# EAGLE schematic scale (EAGLE 9.6.2)
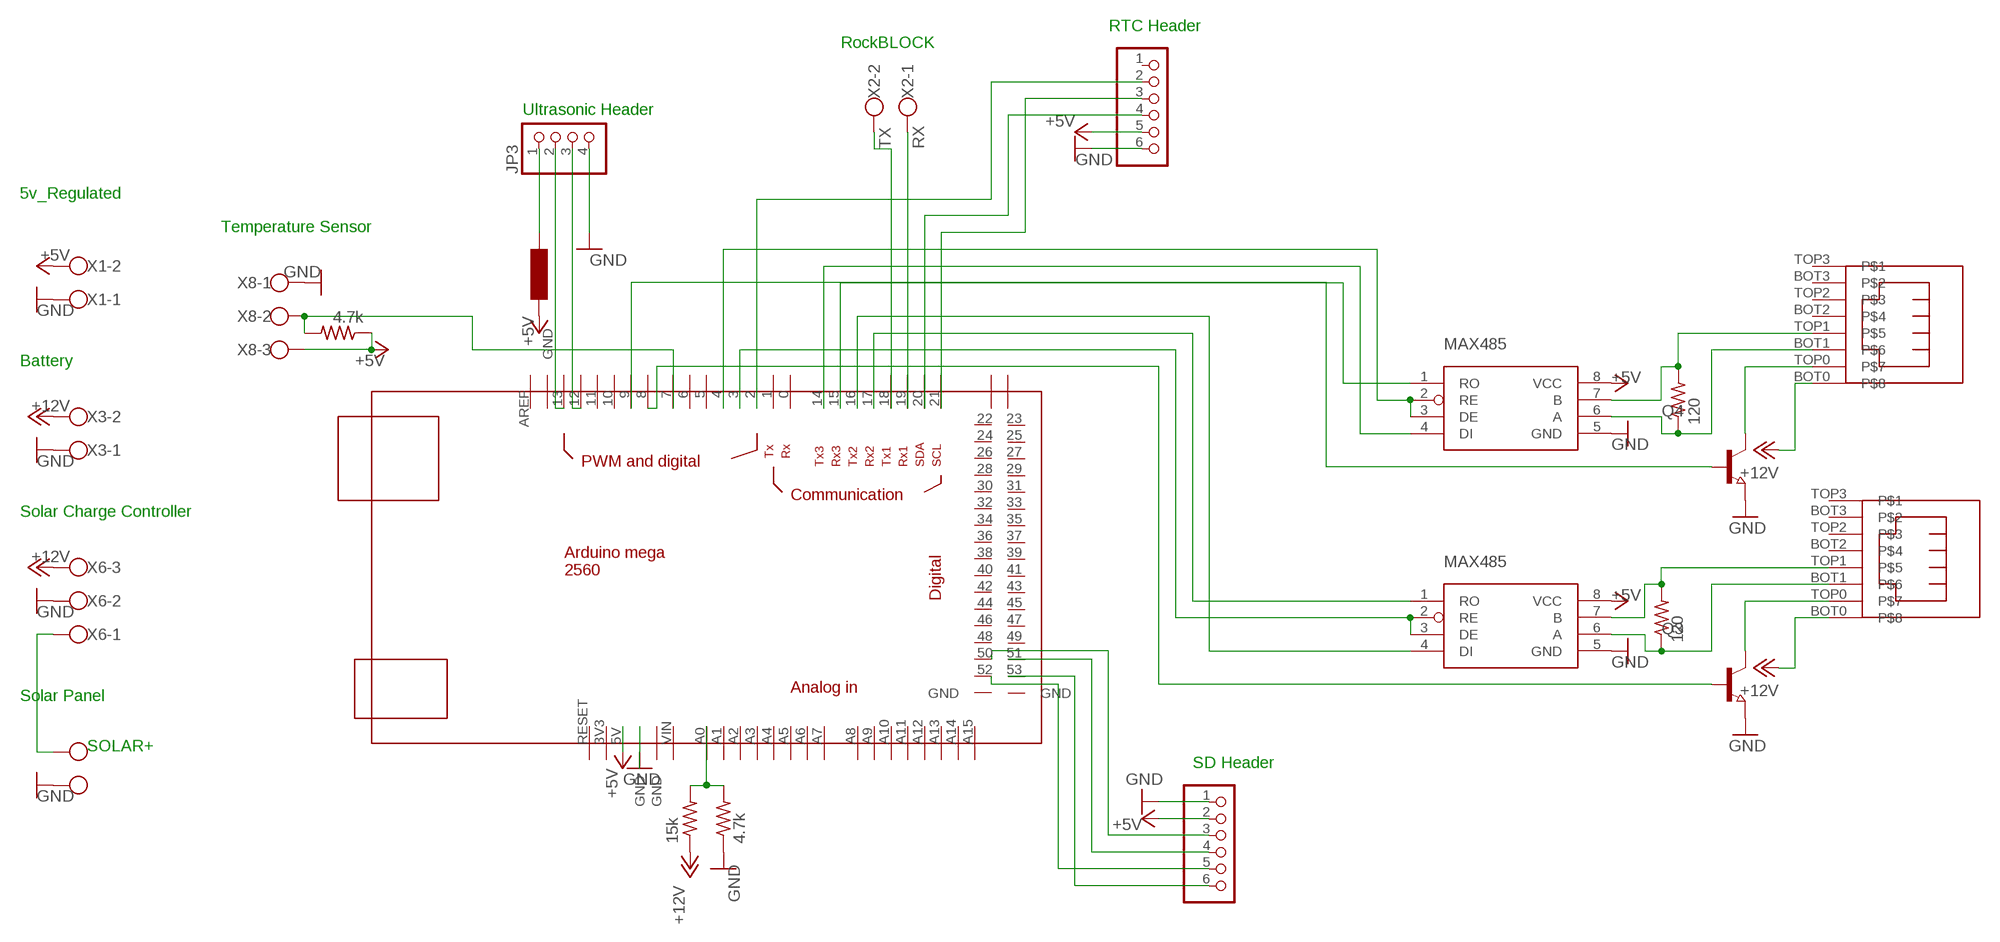
[diagram p0: schematic, sheet 1]

## Parts
JP1  PINHD-1X6  [1X06]
JP2  PINHD-1X6  [1X06]
JP3  PINHD-1X4  [1X04]
JP4  ETHERNET  [ETHERNET]
JP5  ETHERNET  [ETHERNET]
L1  100uH  NLFV32T-101K-EF  [NLFV32T-101K-EF]
Q3  NPN-TRANSISTOR_SOT23  [SOT23]
Q4  NPN-TRANSISTOR_SOT23  [SOT23]
R1  120  R-US_R0805  [R0805]
R3  4.7k  R-US_R0805  [R0805]
R7  120  R-US_R0805  [R0805]
R8  15k  R-US_R0805  [R0805]
R9  4.7k  R-US_R0805  [R0805]
U$1  MAX485  [SO08]
U$2  MAX485  [SO08]
U$3  MEGA_DEVICE  [MEGAOUTLINE]
X1  W237-102  [W237-102]
X2  W237-102  [W237-102]
X3  W237-102  [W237-102]
X6  W237-103  [W237-103]
X7  W237-102  [W237-102]
X8  W237-103  [W237-103]

## Nets
+5V: JP1.2 JP2.5 L1.P$1 R3.1 U$1.8(VCC) U$2.8(VCC) U$3.5V X1.2 X8.3
+12V: JP4.BOT0 JP5.BOT0 R8.1 X3.2 X6.3
GND: JP1.1 JP2.6 JP3.4 Q3.2(E) Q4.2(E) R9.1 U$1.5(GND) U$2.5(GND) U$3.GND@2(GND) X1.1 X3.1 X6.2 X7.1 X8.1
N$1: JP4.TOP1 R1.2 U$1.7(B)
N$2: JP4.BOT1 R1.1 U$1.6(A)
N$3: JP5.TOP1 R7.2 U$2.7(B)
N$4: JP5.BOT1 R7.1 U$2.6(A)
N$5: U$2.1(RO) U$3.17
N$6: U$2.4(DI) U$3.16
N$7: U$1.1(RO) U$3.15
N$8: U$1.4(DI) U$3.14
N$9: JP2.2 U$3.2
N$10: U$2.2(RE) U$2.3(DE) U$3.3
N$11: U$1.2(RE) U$1.3(DE) U$3.4
N$12: JP2.3 U$3.21
N$13: JP2.4 U$3.20
N$14: JP1.6 U$3.53
N$15: JP1.5 U$3.52
N$16: JP1.4 U$3.51
N$17: JP1.3 U$3.50
N$18: JP3.2 U$3.13
N$19: JP3.3 U$3.12
N$20: Q3.1(B) U$3.8
N$21: JP4.TOP0 Q4.3(C)
N$22: JP5.TOP0 Q3.3(C)
N$24: Q4.1(B) U$3.9
N$26: JP3.1 L1.P$2
N$27: R8.2 R9.2 U$3.A0
N$28: X6.1 X7.2
N$29: R3.2 U$3.7 X8.2
RX: U$3.19 X2.1
TX: U$3.18 X2.2
Unconnected: JP2.1 JP4.BOT2 JP4.BOT3 JP4.TOP2 JP4.TOP3 JP5.BOT2 JP5.BOT3 JP5.TOP2 JP5.TOP3 U$3.0 U$3.1 U$3.3V3 U$3.5 U$3.6 U$3.10 U$3.11 U$3.22 U$3.23 U$3.24 U$3.25 U$3.26 U$3.27 U$3.28 U$3.29 U$3.30 U$3.31 U$3.32 U$3.33 U$3.34 U$3.35 U$3.36 U$3.37 U$3.38 U$3.39 U$3.40 U$3.41 U$3.42 U$3.43 U$3.44 U$3.45 U$3.46 U$3.47 U$3.48 U$3.49 U$3.A1 U$3.A2 U$3.A3 U$3.A4 U$3.A5 U$3.A6 U$3.A7 U$3.A8 U$3.A9 U$3.A10 U$3.A11 U$3.A12 U$3.A13 U$3.A14 U$3.A15 U$3.AREF U$3.GND@1(GND) U$3.GND@3(GND) U$3.GND@4(5V) U$3.GND@5(5V) U$3.GND@6(GND) U$3.GND@7(GND) U$3.RESET U$3.VIN

## Notes on the sheet
- RTC Header
- RockBLOCK
- Ultrasonic Header
- TX | RX
- 5v_Regulated
- Temperature Sensor
- Battery
- Solar Charge Controller
- Solar Panel
- SOLAR+
- SD Header

## Library data of the parts
JP1 JP2 = pinhead:PINHD-1X6: PIN HEADER
JP3 = pinhead:PINHD-1X4: PIN HEADER
JP4 JP5 = Ethernet:ETHERNET
L1 = NLFV32T-101K-EF:NLFV32T-101K-EF
Q3 Q4 = semicon-smd-ipc:NPN-TRANSISTOR_: NPN TRANSISTOR
R1 R3 R7-R9 = rcl:R-US_: RESISTOR, American symbol; SPICEPREFIX: R
U$1 U$2 = MAX485:MAX485: Check prices <https://pricing.snapeda.com/parts/MAX485/Maxim%20Integrated/view-part?ref=eda>
U$3 = ArduinoMegaOutline:MEGA_DEVICE: mega card as device
X1-X3 X7 = con-wago-500:W237-102: WAGO SCREW CLAMP; MPN: 237-102; OC_FARNELL: unknown; OC_NEWARK: 70K9898
X6 X8 = con-wago-500:W237-103: WAGO SCREW CLAMP; MPN: 237-103; OC_FARNELL: unknown; OC_NEWARK: 18M7116